# Altium schematic sheet LED Driver - ZXLD1360ET5TA.SchDoc
size A4
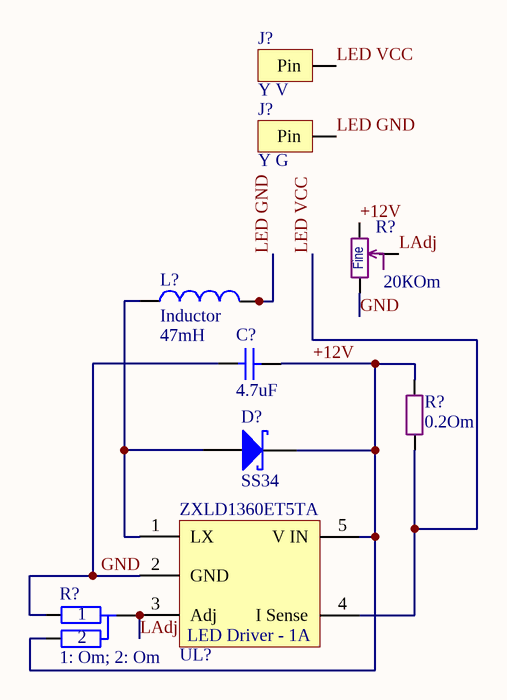
[diagram p0: LED Driver - ZXLD1360ET5TA.SchDoc]

## Parts
(Parts that share a designator on the sheet are numbered #1, #2 ... from top to bottom, then left to right.)
C?  4.7uF  [SMD 1206 (3216)]
D?  SS34  [DO-214AC (SMA)]
J?#1  Y V  [OnePin 1.2x3]
J?#2  Y G  [OnePin 1.2x3]
L?  Inductor  value 47mH  [47 mkH]
R?#1  20КOm  [Res Adj 2.54 X 3]
R?#2  0.2Om  [SMD 2512 (6432)]
R?#3  1: Om; 2: Om  [SMD 0805 (2012) Double]
UL?  ZXLD1360ET5TA  [SOT-23-5]

## Nets
+12V: C?.2 D?.K R?#1.3 R?#2.2 R?#3.2 UL?.5(V_IN)
GND: C?.1 R?#1.1 R?#3.1 UL?.2(GND)
LAdj: R?#1.2 R?#3.3 UL?.3(Adj)
LED GND: J?#2.1(Pin) L?.2
LED VCC: J?#1.1(Pin) R?#2.1 UL?.4(I_Sense)
NetD?_A: D?.A L?.1 UL?.1(LX)

## Notes on the sheet
- (in symbol Res Adj 3296) Fine
- (in symbol ZXLD1360ET5TA) LED Driver - 1A

## Library data of the parts
C? = Cap SMD 0402-1812: Capacitor
D? = D Shotki All: Shotki  Diode; VALUE: 1N5822; PackageReference: DO-201
J?#1 J?#2 = OnePin Connector: Only pad
L? = Inductor: Code_IEC: 1005; Published: 8-Jun-2000; LatestRevisionDate: 29-May-2009; LatestRevisionNote: IPC-7351 Footprint Added.; PackageReference: 0402-A; Publisher: Altium Limited; PackageDescription: Chip Inductor; Code_JEITA: 0402
R?#1 = Res Adj 3296
R?#2 = Res All Types
R?#3 = Res SMD (Select one way): Choice from two resistors
UL? = ZXLD1360ET5TA: Led Driver - 1A, 7-30V In; PackageDescription: SOT-23-5; ComponentLink1URL: www.zetex.com; DataSheet URL: https://lib.chipdip.ru/296/DOC000296166.pdf; Name: ZXLD1360ET5TA